# Altium schematic sheet 1_BLOCK.SchDoc
size A4
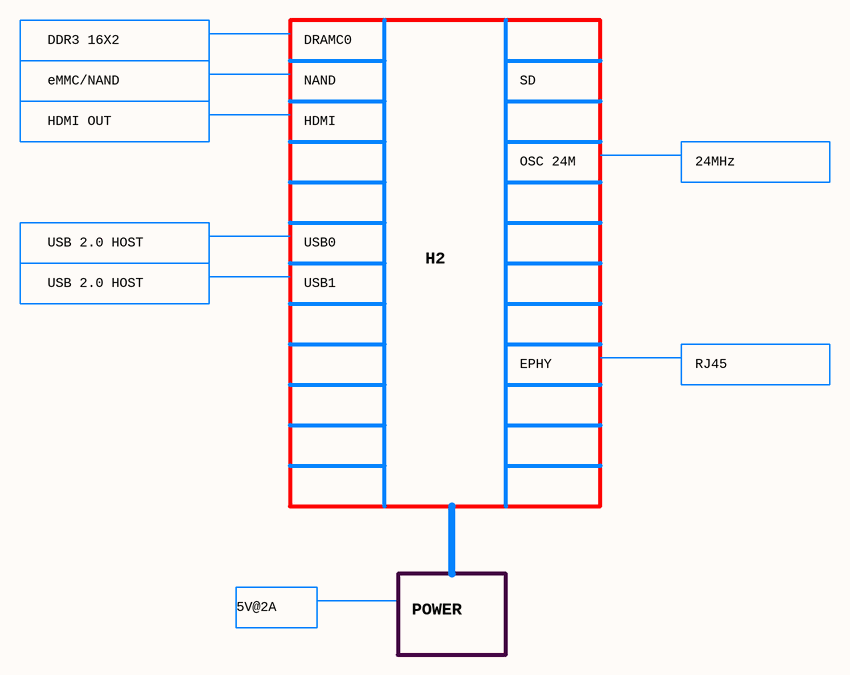
[diagram p0: 1_BLOCK.SchDoc]

## Notes on the sheet
- DDR3 16X2
- DRAMC0
- eMMC/NAND
- NAND
- SD
- HDMI OUT
- HDMI
- OSC 24M
- 24MHz
- USB 2.0 HOST
- USB0
- USB1
- H2
- EPHY
- RJ45
- 5V@2A
- POWER